# EAGLE schematic Lost-Tile-v1.0.0 v1 (EAGLE 9.7.0)

## Sheet 1 of 5
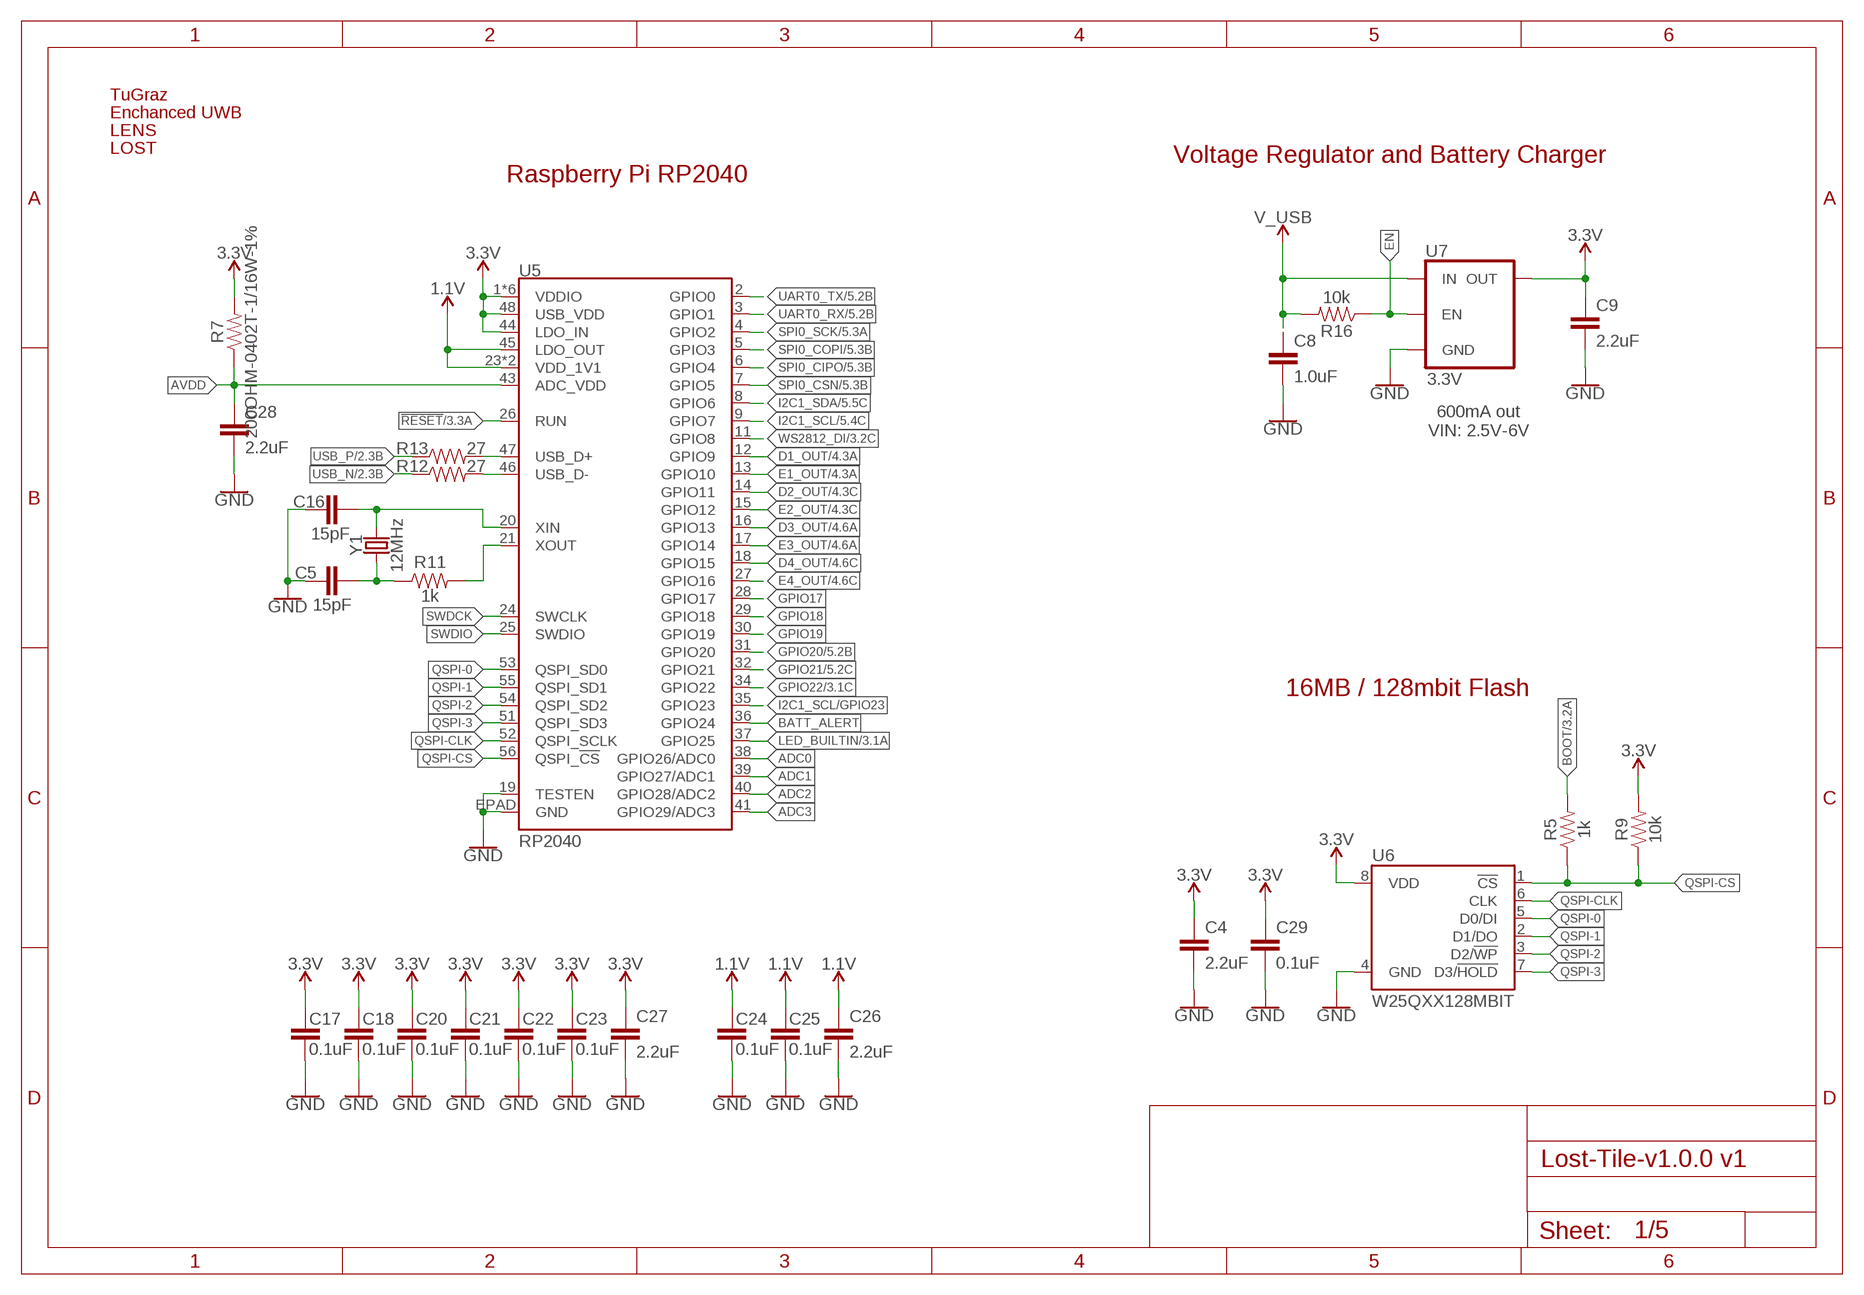
[diagram p0: schematic, sheet 1]

### Parts
C4  2.2uF  2.2UF-0402_TIGHT-10V-10%-X5R  [0402-TIGHT]
C5  15pF  15PF-0402T-50V-5%  [0402-TIGHT]
C8  1.0uF  1.0UF-0402T-16V-10%  [0402-TIGHT]
C9  2.2uF  2.2UF-0402_TIGHT-10V-10%-X5R  [0402-TIGHT]
C16  15pF  15PF-0402T-50V-5%  [0402-TIGHT]
C17  0.1uF  0.1UF-0402T-6.3V-10%-X7R  [0402-TIGHT]
C18  0.1uF  0.1UF-0402T-6.3V-10%-X7R  [0402-TIGHT]
C20  0.1uF  0.1UF-0402T-6.3V-10%-X7R  [0402-TIGHT]
C21  0.1uF  0.1UF-0402T-6.3V-10%-X7R  [0402-TIGHT]
C22  0.1uF  0.1UF-0402T-6.3V-10%-X7R  [0402-TIGHT]
C23  0.1uF  0.1UF-0402T-6.3V-10%-X7R  [0402-TIGHT]
C24  0.1uF  0.1UF-0402T-6.3V-10%-X7R  [0402-TIGHT]
C25  0.1uF  0.1UF-0402T-6.3V-10%-X7R  [0402-TIGHT]
C26  2.2uF  2.2UF-0402_TIGHT-10V-10%-X5R  [0402-TIGHT]
C27  2.2uF  2.2UF-0402_TIGHT-10V-10%-X5R  [0402-TIGHT]
C28  2.2uF  2.2UF-0402_TIGHT-10V-10%-X5R  [0402-TIGHT]
C29  0.1uF  0.1UF-0402T-6.3V-10%-X7R  [0402-TIGHT]
LG1  TU-LOGOSMALL-BICOL  [TU-LOGO-SMALL-BICOL]
LG2  EUWBBICOL  [EUWB_LOGO-BICOL]
LG3  LENS  [LENS]
LG4  LOST_LOGO  [LOST_LOGO]
R5  1k  1KOHM-0402T-1/16W-1%  [0402-TIGHT]
R7  200OHM-0402T-1/16W-1%  [0402-TIGHT]
R9  10k  10KOHM-0402T-1/16W-1%  [0402-TIGHT]
R11  1k  1KOHM-0402T-1/16W-1%  [0402-TIGHT]
R12  27  27OHM  [0402-TIGHT]
R13  27  27OHM  [0402-TIGHT]
R16  10k  10KOHM-0402T-1/16W-1%  [0402-TIGHT]
U5  RP2040  [QFN-56]
U6  W25QXX128MBIT  W25QXX128MBIT-6X5-SKINNY_CENTER  [WSON-8-6X5-SKINNY_CENTERPAD]
U7  3.3V  V_REG_AP2112K-3.3V  [SOT23-5]
Y1  12MHz  CRYSTAL-12MHZ  [CRYSTAL-SMD-2X2.5MM]

### Nets
1.1V: C24.1 C25.1 C26.1 U5.23(VDD_1V1) U5.45(LDO_OUT) U5.50(VDD_1V1)
3.3V: C4.1 C9.1 C17.1 C18.1 C20.1 C21.1 C22.1 C23.1 C27.1 C29.1 R7.2 R9.2 U5.1(VDDIO) U5.10(VDDIO) U5.22(VDDIO) U5.33(VDDIO) U5.42(VDDIO) U5.44(LDO_IN) U5.48(USB_VDD) U5.49(VDDIO) U6.8(VDD) U7.5(OUT) ; also sheet 4,5
!RESET!: U5.26(RUN) ; also sheet 3
ADC0: U5.38(GPIO26/ADC0)
ADC1: U5.39(GPIO27/ADC1)
ADC2: U5.40(GPIO28/ADC2)
ADC3: U5.41(GPIO29/ADC3)
AVDD: C28.1 R7.1 U5.43(ADC_VDD)
BATT_ALERT: U5.36(GPIO24)
BOOT: R5.2 ; also sheet 3
D1_OUT: U5.12(GPIO9) ; also sheet 4
D2_OUT: U5.14(GPIO11) ; also sheet 4
D3_OUT: U5.16(GPIO13) ; also sheet 4
D4_OUT: U5.18(GPIO15) ; also sheet 4
E1_OUT: U5.13(GPIO10) ; also sheet 4
E2_OUT: U5.15(GPIO12) ; also sheet 4
E3_OUT: U5.17(GPIO14) ; also sheet 4
E4_OUT: U5.27(GPIO16) ; also sheet 4
EN: R16.1 U7.3(EN)
GND: C4.2 C5.1 C8.2 C9.2 C16.1 C17.2 C18.2 C20.2 C21.2 C22.2 C23.2 C24.2 C25.2 C26.2 C27.2 C28.2 C29.2 U5.19(TESTEN) U5.EPAD(GND) U6.4(GND) U7.2(GND) ; also sheet 2,3,4,5
GPIO17: U5.28(GPIO17)
GPIO18: U5.29(GPIO18)
GPIO19: U5.30(GPIO19)
GPIO20: U5.31(GPIO20) ; also sheet 5
GPIO21: U5.32(GPIO21) ; also sheet 5
GPIO22: U5.34(GPIO22) ; also sheet 3
I2C1_SCL: U5.9(GPIO7) ; also sheet 5
I2C1_SCL/GPIO23: U5.35(GPIO23)
I2C1_SDA: U5.8(GPIO6) ; also sheet 5
LED_BUILTIN: U5.37(GPIO25) ; also sheet 3
N$4: R11.2 U5.21(XOUT)
N$5: C16.2 U5.20(XIN) Y1.P3
N$6: C5.2 R11.1 Y1.P1
QSPI-0: U5.53(QSPI_SD0) U6.5(D0/DI)
QSPI-1: U5.55(QSPI_SD1) U6.2(D1/DO)
QSPI-2: U5.54(QSPI_SD2) U6.3(D2/!WP!)
QSPI-3: U5.51(QSPI_SD3) U6.7(D3/!HOLD!)
QSPI-CLK [Clock]: U5.52(QSPI_SCLK) U6.6(CLK)
QSPI-CS: R5.1 R9.1 U5.56(QSPI_!CS!) U6.1(!CS!)
SPI0_CIPO: U5.6(GPIO4) ; also sheet 5
SPI0_COPI: U5.5(GPIO3) ; also sheet 5
SPI0_CSN: U5.7(GPIO5) ; also sheet 5
SPI0_SCK: U5.4(GPIO2) ; also sheet 5
SWDCK: U5.24(SWCLK)
SWDIO: U5.25(SWDIO)
UART0_RX: U5.3(GPIO1) ; also sheet 5
UART0_TX: U5.2(GPIO0) ; also sheet 5
USB_F_N: R12.2 U5.46(USB_D-)
USB_F_P: R13.2 U5.47(USB_D+)
USB_N: R12.1 ; also sheet 2
USB_P: R13.1 ; also sheet 2
V_USB: C8.1 R16.2 U7.1(IN) ; also sheet 2,3
WS2812_DI: U5.11(GPIO8) ; also sheet 3

### Notes on the sheet
- Voltage Regulator and Battery Charger
- Raspberry Pi RP2040
- 600mA out
  VIN: 2.5V-6V
- 16MB / 128mbit Flash

## Sheet 2 of 5
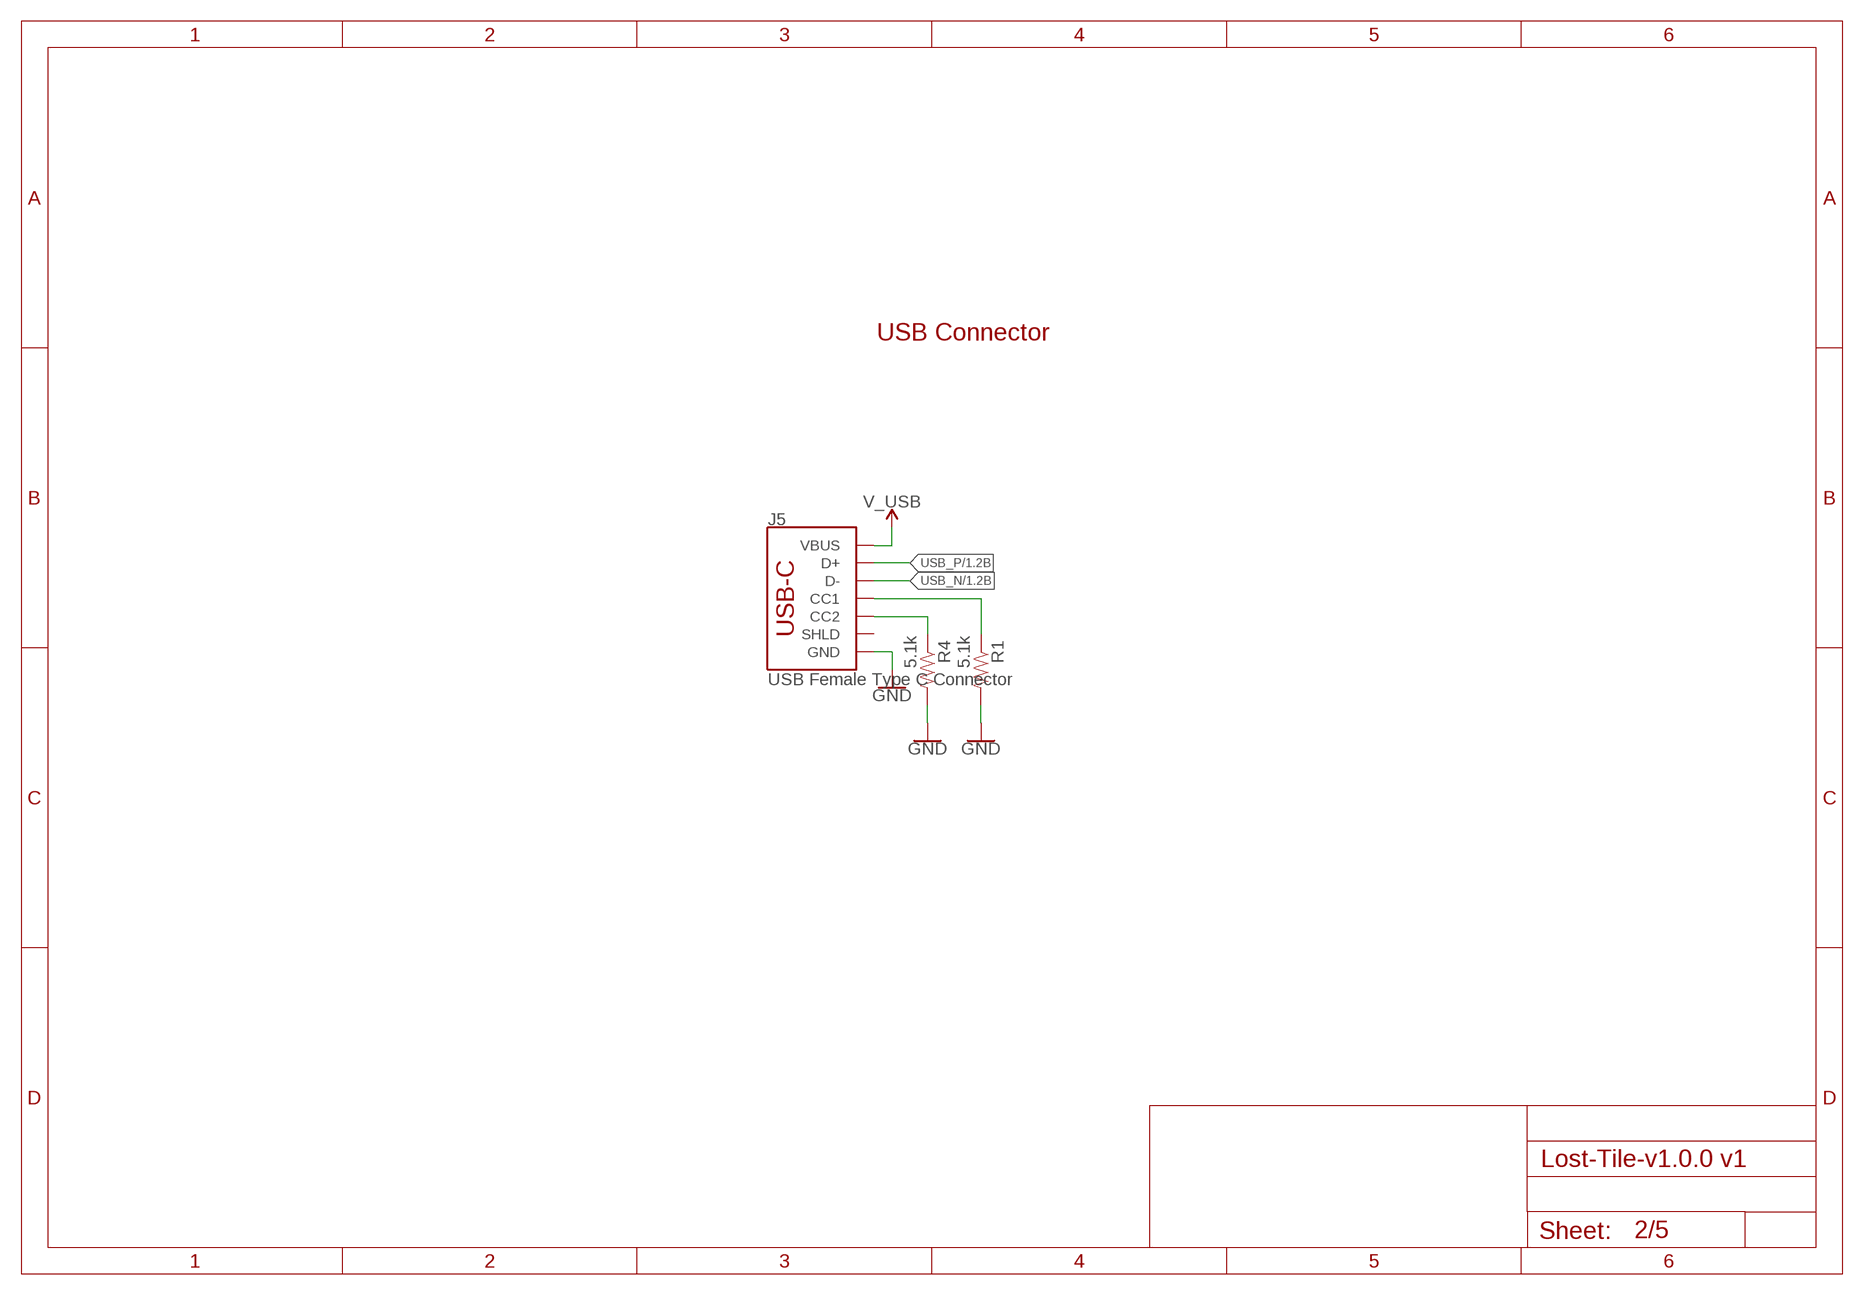
[diagram p1: schematic, sheet 2]

### Parts
J5  USB Female Type C Connector  USB_C_4-LAYER-ISOLATED  [USB-C-16P-4LAYER-ISOLATED]
R1  5.1k  5.1KOHM-0402T-1/16W-1%  [0402-TIGHT]
R4  5.1k  5.1KOHM-0402T-1/16W-1%  [0402-TIGHT]

### Nets
GND: J5.GND J5.GND2(GND) R1.2 R4.2 ; also sheet 1,3,4,5
N$11: J5.A5(CC1) R1.1
N$12: J5.B5(CC2) R4.1
USB_N: J5.A7(D-) J5.B7(D-) ; also sheet 1
USB_P: J5.A6(D+) J5.B6(D+) ; also sheet 1
V_USB: J5.VBUS1(VBUS) J5.VBUS2(VBUS) ; also sheet 1,3
Unconnected: J5.SHLD1(SHLD) J5.SHLD2(SHLD) J5.SHLD3(SHLD) J5.SHLD4(SHLD) J5.SHLD5(SHLD) J5.SHLD6(SHLD) J5.SHLD7(SHLD) J5.SHLD8(SHLD)

### Notes on the sheet
- USB Connector

## Sheet 3 of 5
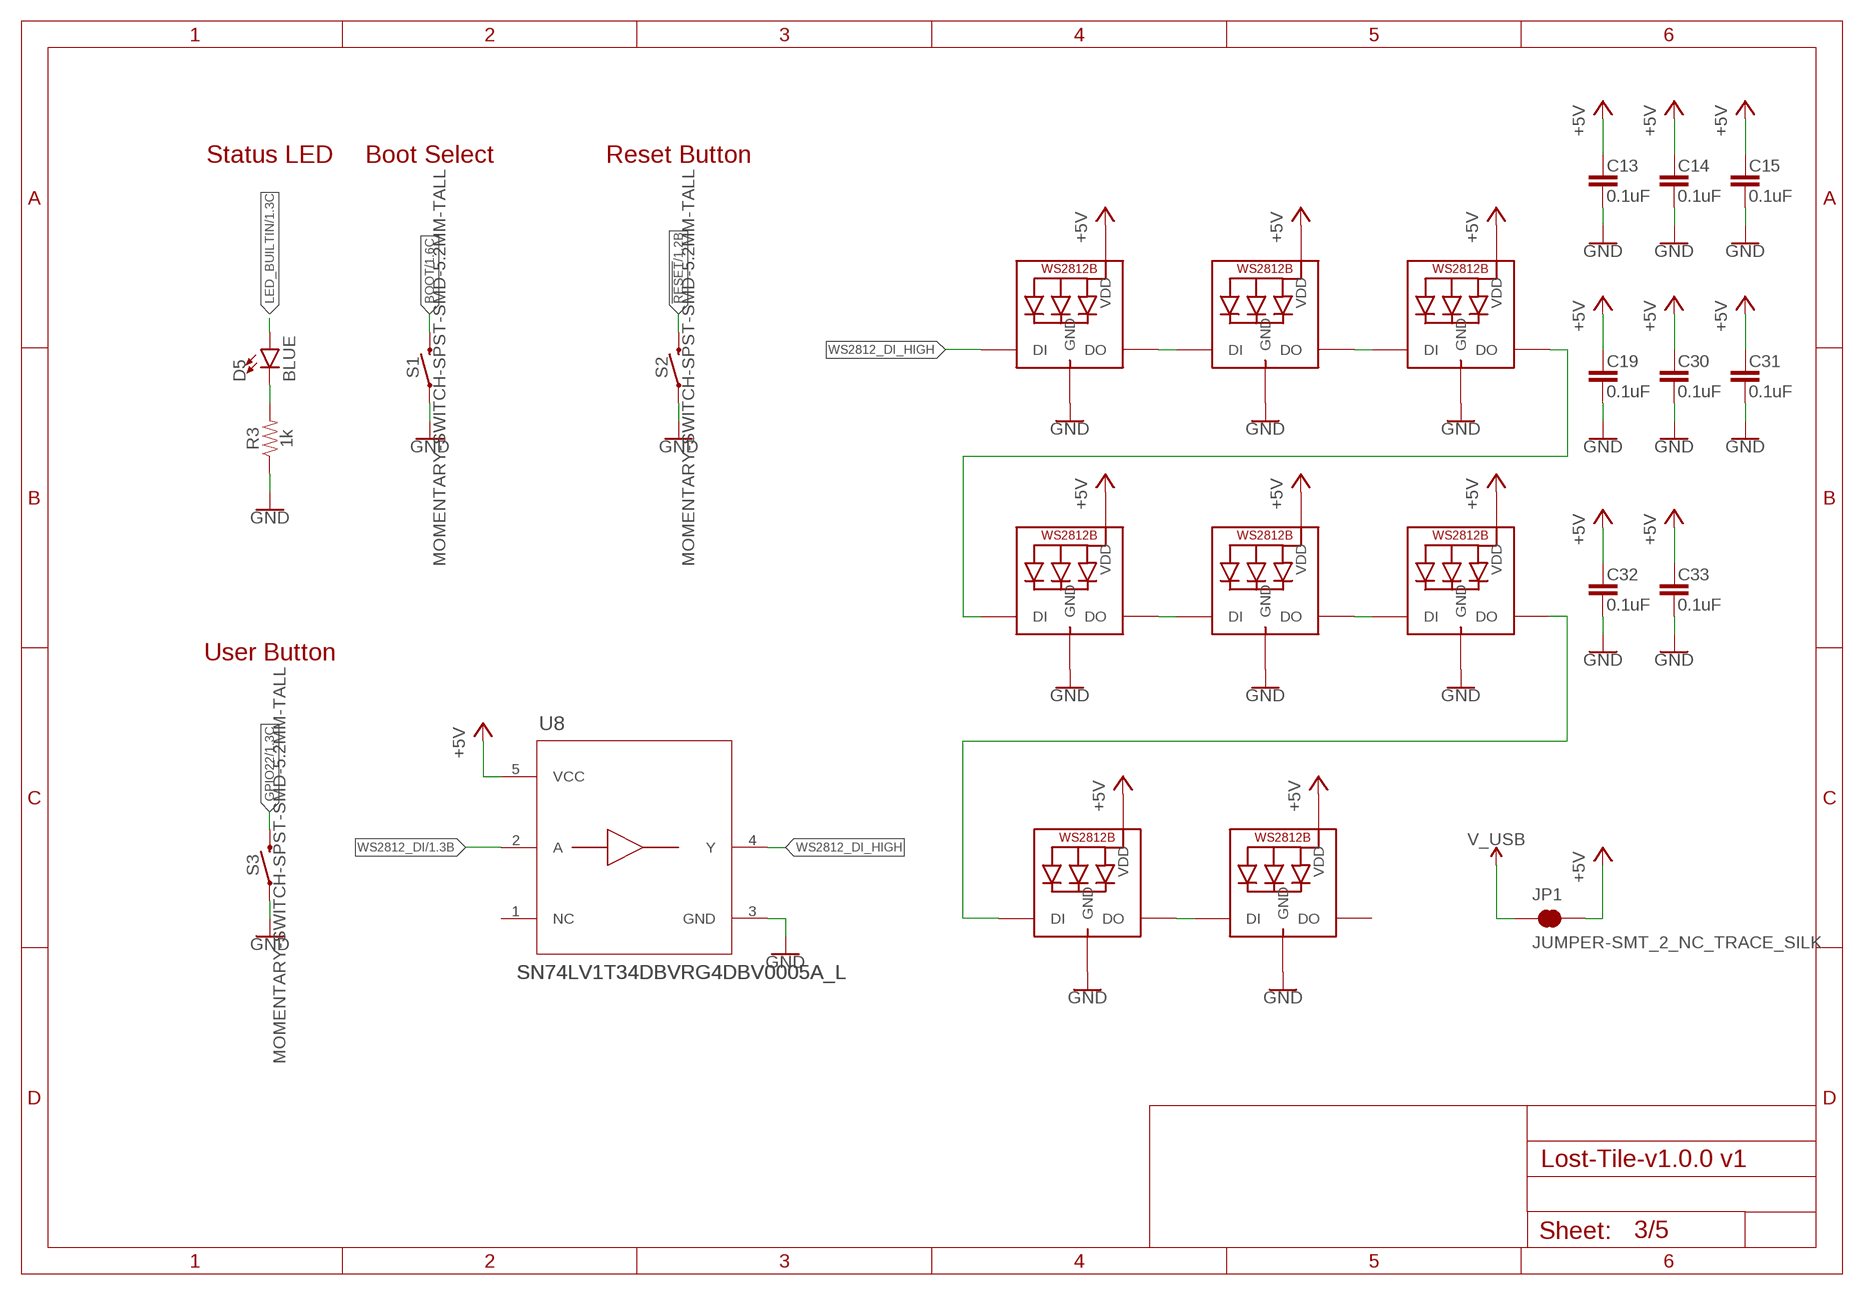
[diagram p2: schematic, sheet 3]

### Parts
C13  0.1uF  0.1UF-0402T-6.3V-10%-X7R  [0402-TIGHT]
C14  0.1uF  0.1UF-0402T-6.3V-10%-X7R  [0402-TIGHT]
C15  0.1uF  0.1UF-0402T-6.3V-10%-X7R  [0402-TIGHT]
C19  0.1uF  0.1UF-0402T-6.3V-10%-X7R  [0402-TIGHT]
C30  0.1uF  0.1UF-0402T-6.3V-10%-X7R  [0402-TIGHT]
C31  0.1uF  0.1UF-0402T-6.3V-10%-X7R  [0402-TIGHT]
C32  0.1uF  0.1UF-0402T-6.3V-10%-X7R  [0402-TIGHT]
C33  0.1uF  0.1UF-0402T-6.3V-10%-X7R  [0402-TIGHT]
D5  BLUE  LED-BLUE0603  [LED-0603]
JP1  JUMPER-SMT_2_NC_TRACE_SILK  [SMT-JUMPER_2_NC_TRACE_SILK]
LED1  WS2812B5050  [WS2812B]
LED2  WS2812B5050  [WS2812B]
LED3  WS2812B5050  [WS2812B]
LED4  WS2812B5050  [WS2812B]
LED5  WS2812B5050  [WS2812B]
LED6  WS2812B5050  [WS2812B]
LED7  WS2812B5050  [WS2812B]
LED8  WS2812B5050  [WS2812B]
R3  1k  1KOHM-0402T-1/16W-1%  [0402-TIGHT]
S1  MOMENTARY-SWITCH-SPST-SMD-5.2MM-TALL  [TACTILE_SWITCH_SMD_5.2MM]
S2  MOMENTARY-SWITCH-SPST-SMD-5.2MM-TALL  [TACTILE_SWITCH_SMD_5.2MM]
S3  MOMENTARY-SWITCH-SPST-SMD-5.2MM-TALL  [TACTILE_SWITCH_SMD_5.2MM]
U8  SN74LV1T34DBVRG4DBV0005A_L  [DBV0005A_L]

### Nets
!RESET!: S2.3 ; also sheet 1
+5V: C13.1 C14.1 C15.1 C19.1 C30.1 C31.1 C32.1 C33.1 JP1.2 LED1.1-VDD(VDD) LED2.1-VDD(VDD) LED3.1-VDD(VDD) LED4.1-VDD(VDD) LED5.1-VDD(VDD) LED6.1-VDD(VDD) LED7.1-VDD(VDD) LED8.1-VDD(VDD) U8.5(VCC) ; also sheet 5
BOOT: S1.3 ; also sheet 1
GND: C13.2 C14.2 C15.2 C19.2 C30.2 C31.2 C32.2 C33.2 LED1.3-GND(GND) LED2.3-GND(GND) LED3.3-GND(GND) LED4.3-GND(GND) LED5.3-GND(GND) LED6.3-GND(GND) LED7.3-GND(GND) LED8.3-GND(GND) R3.1 S1.1 S2.1 S3.1 U8.3(GND) ; also sheet 1,2,4,5
GPIO22: S3.3 ; also sheet 1
LED_BUILTIN: D5.A ; also sheet 1
N$1: D5.C R3.2
N$2: LED1.2-DOUT(DO) LED2.4-DIN(DI)
N$3: LED2.2-DOUT(DO) LED3.4-DIN(DI)
N$7: LED6.2-DOUT(DO) LED7.4-DIN(DI)
N$9: LED3.2-DOUT(DO) LED4.4-DIN(DI)
N$10: LED7.2-DOUT(DO) LED8.4-DIN(DI)
N$13: LED4.2-DOUT(DO) LED5.4-DIN(DI)
N$14: LED5.2-DOUT(DO) LED6.4-DIN(DI)
V_USB: JP1.1 ; also sheet 1,2
WS2812_DI: U8.2(A) ; also sheet 1
WS2812_DI_HIGH: LED1.4-DIN(DI) U8.4(Y)
Unconnected: LED8.2-DOUT(DO) U8.1(NC)

### Notes on the sheet
- Status LED | Boot Select | Reset Button
- User Button

## Sheet 4 of 5
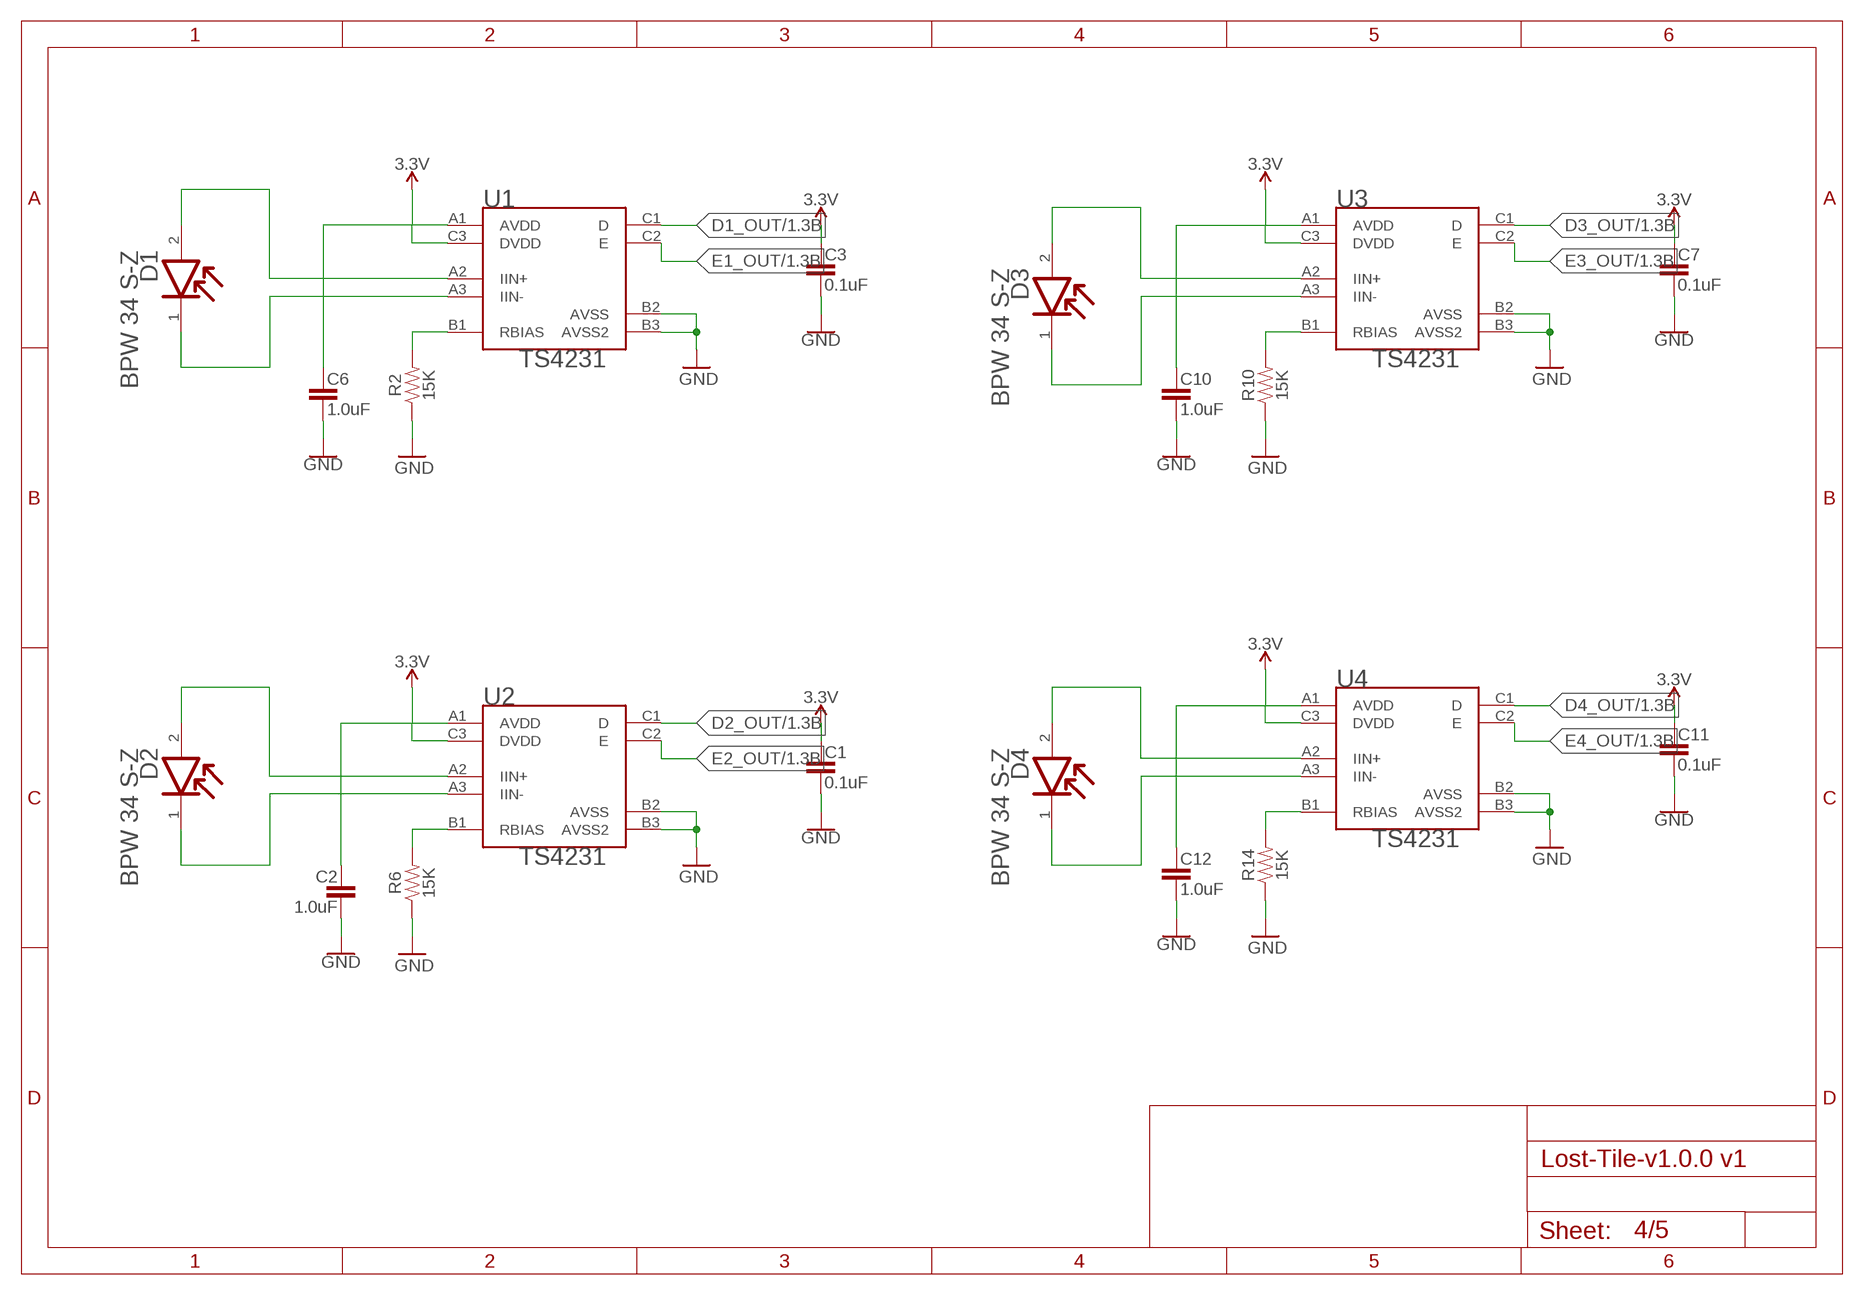
[diagram p3: schematic, sheet 4]

### Parts
C1  0.1uF  0.1UF-0402T-6.3V-10%-X7R  [0402-TIGHT]
C2  1.0uF  1.0UF-0402T-16V-10%  [0402-TIGHT]
C3  0.1uF  0.1UF-0402T-6.3V-10%-X7R  [0402-TIGHT]
C6  1.0uF  1.0UF-0402T-16V-10%  [0402-TIGHT]
C7  0.1uF  0.1UF-0402T-6.3V-10%-X7R  [0402-TIGHT]
C10  1.0uF  1.0UF-0402T-16V-10%  [0402-TIGHT]
C11  0.1uF  0.1UF-0402T-6.3V-10%-X7R  [0402-TIGHT]
C12  1.0uF  1.0UF-0402T-16V-10%  [0402-TIGHT]
D1  OSRAM_OPTO_SEMICONDUCTORS_INC._BPW_34_S-ZOSRAM_OPTO_SEMICONDUCTORS_INC._BPW_34_S-Z_0_0  [OSRAM_OPTO_SEMICONDUCTORS_INC._BPW_34_S-Z_0]
D2  OSRAM_OPTO_SEMICONDUCTORS_INC._BPW_34_S-ZOSRAM_OPTO_SEMICONDUCTORS_INC._BPW_34_S-Z_0_0  [OSRAM_OPTO_SEMICONDUCTORS_INC._BPW_34_S-Z_0]
D3  OSRAM_OPTO_SEMICONDUCTORS_INC._BPW_34_S-ZOSRAM_OPTO_SEMICONDUCTORS_INC._BPW_34_S-Z_0_0  [OSRAM_OPTO_SEMICONDUCTORS_INC._BPW_34_S-Z_0]
D4  OSRAM_OPTO_SEMICONDUCTORS_INC._BPW_34_S-ZOSRAM_OPTO_SEMICONDUCTORS_INC._BPW_34_S-Z_0_0  [OSRAM_OPTO_SEMICONDUCTORS_INC._BPW_34_S-Z_0]
R2  15K  15KOHM-0402-TIGHT-1/16THW-1%  [0402-TIGHT]
R6  15K  15KOHM-0402-TIGHT-1/16THW-1%  [0402-TIGHT]
R10  15K  15KOHM-0402-TIGHT-1/16THW-1%  [0402-TIGHT]
R14  15K  15KOHM-0402-TIGHT-1/16THW-1%  [0402-TIGHT]
U1  TRIAD_SEMI_TS4231TRIAD_SEMI_TS4231_0_0  [TRIAD_SEMI_TS4231_0]
U2  TRIAD_SEMI_TS4231TRIAD_SEMI_TS4231_0_0  [TRIAD_SEMI_TS4231_0]
U3  TRIAD_SEMI_TS4231TRIAD_SEMI_TS4231_0_0  [TRIAD_SEMI_TS4231_0]
U4  TRIAD_SEMI_TS4231TRIAD_SEMI_TS4231_0_0  [TRIAD_SEMI_TS4231_0]

### Nets
3.3V: C1.1 C3.1 C7.1 C11.1 U1.C3(DVDD) U2.C3(DVDD) U3.C3(DVDD) U4.C3(DVDD) ; also sheet 1,5
D1_OUT: U1.C1(D) ; also sheet 1
D2_OUT: U2.C1(D) ; also sheet 1
D3_OUT: U3.C1(D) ; also sheet 1
D4_OUT: U4.C1(D) ; also sheet 1
E1_OUT: U1.C2(E) ; also sheet 1
E2_OUT: U2.C2(E) ; also sheet 1
E3_OUT: U3.C2(E) ; also sheet 1
E4_OUT: U4.C2(E) ; also sheet 1
GND: C1.2 C2.2 C3.2 C6.2 C7.2 C10.2 C11.2 C12.2 R2.1 R6.1 R10.1 R14.1 U1.B2(AVSS) U1.B3(AVSS2) U2.B2(AVSS) U2.B3(AVSS2) U3.B2(AVSS) U3.B3(AVSS2) U4.B2(AVSS) U4.B3(AVSS2) ; also sheet 1,2,3,5
IIN1+: D1.2(ANODE) U1.A2(IIN+)
IIN1-: D1.1(CATHODE) U1.A3(IIN-)
IIN2+: D2.2(ANODE) U2.A2(IIN+)
IIN2-: D2.1(CATHODE) U2.A3(IIN-)
IIN3+: D3.2(ANODE) U3.A2(IIN+)
IIN3-: D3.1(CATHODE) U3.A3(IIN-)
IIN4+: D4.2(ANODE) U4.A2(IIN+)
IIN4-: D4.1(CATHODE) U4.A3(IIN-)
N$8: C6.1 U1.A1(AVDD)
N$15: C10.1 U3.A1(AVDD)
N$16: C2.1 U2.A1(AVDD)
N$17: C12.1 U4.A1(AVDD)
RBIAS: R2.2 U1.B1(RBIAS)
RBIAS1: R6.2 U2.B1(RBIAS)
RBIAS2: R10.2 U3.B1(RBIAS)
RBIAS3: R14.2 U4.B1(RBIAS)

## Sheet 5 of 5
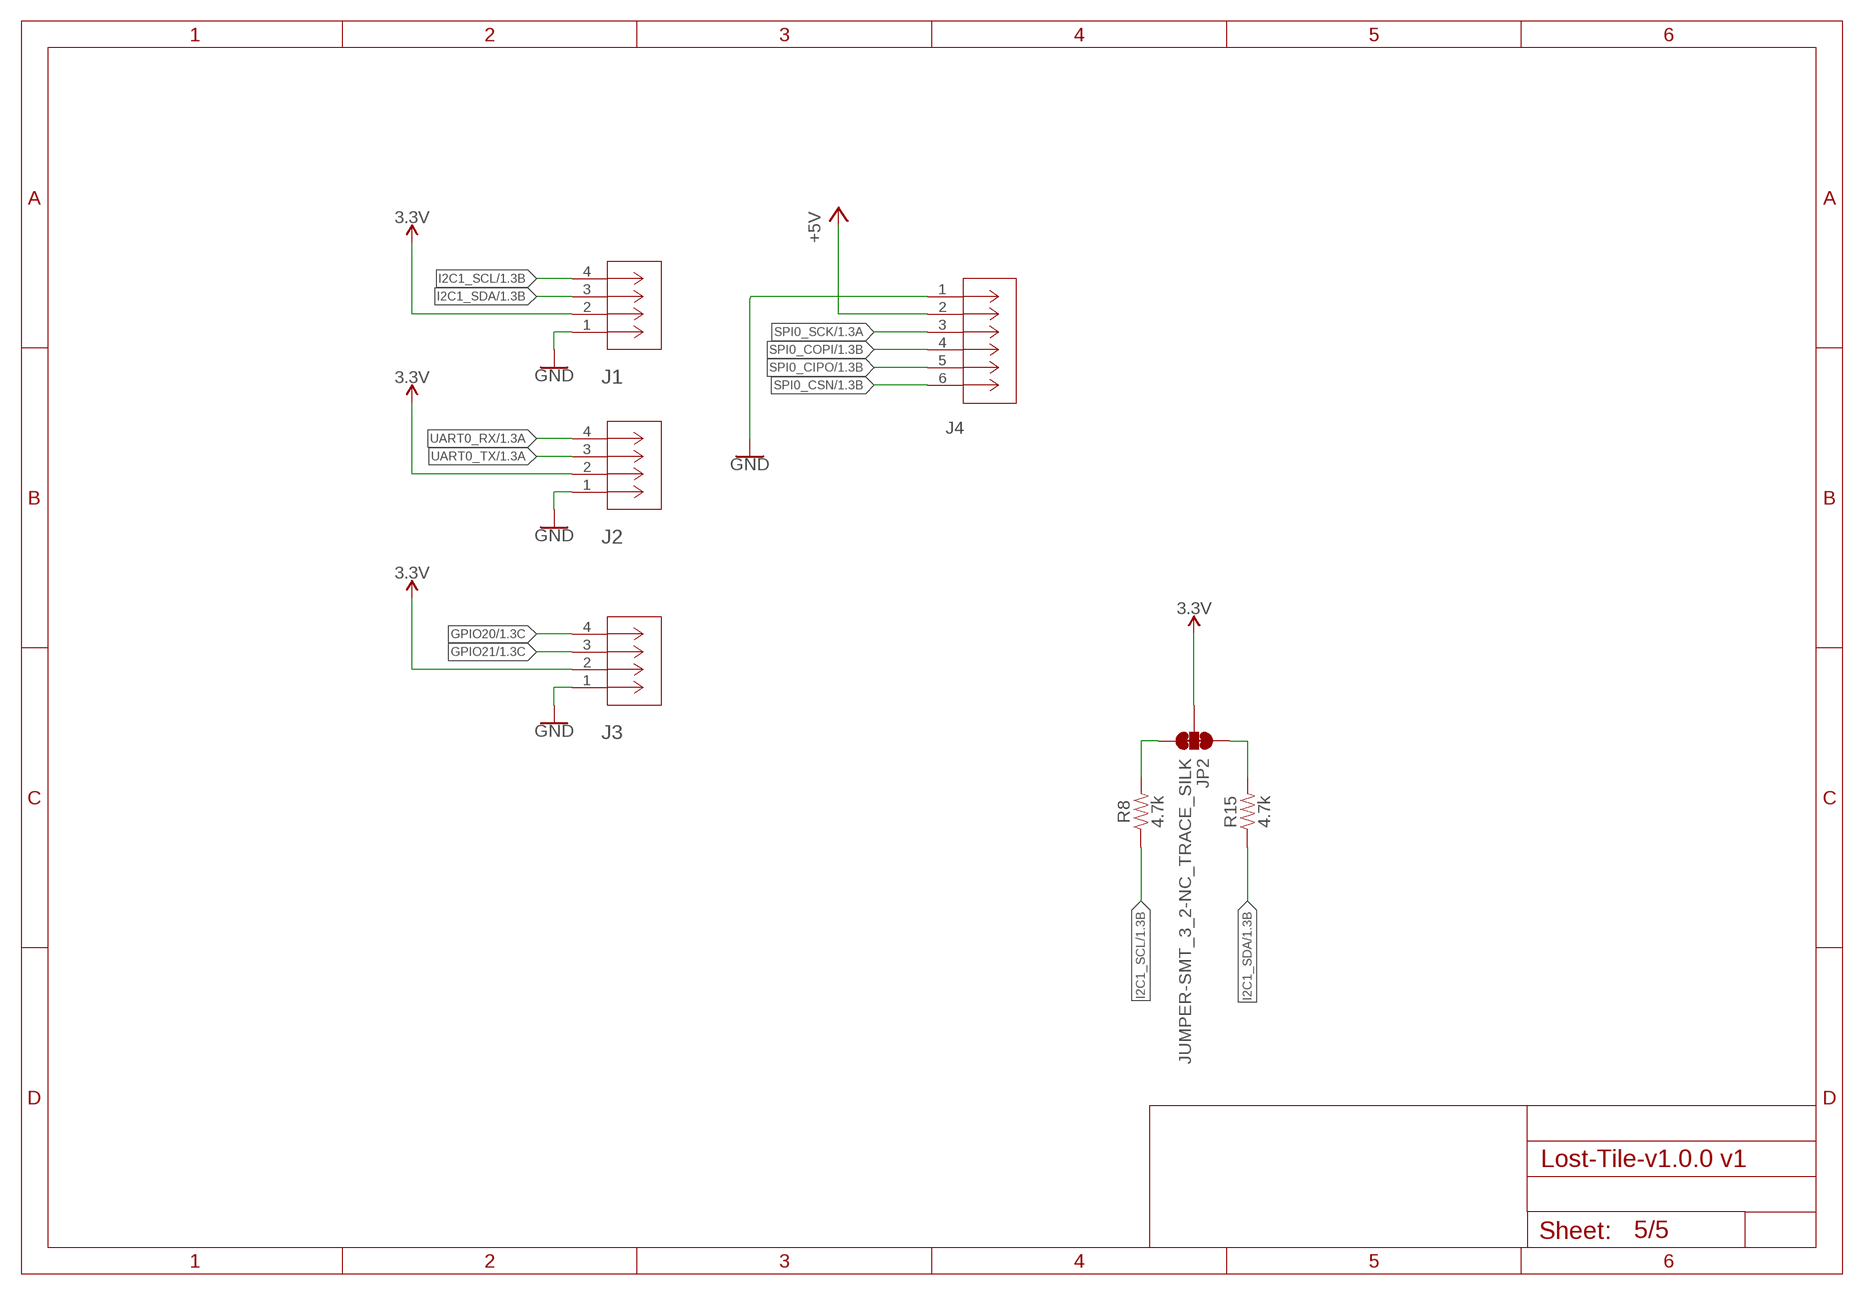
[diagram p4: schematic, sheet 5]

### Parts
J1  BM04B-SRSS-TBT_(LF)(SN)CONN_BM04B-SRSS-TBT_(LF)(SN)_J  [CONN_BM04B-SRSS-TBT_(LF)(SN)_J]
J2  BM04B-SRSS-TBT_(LF)(SN)CONN_BM04B-SRSS-TBT_(LF)(SN)_J  [CONN_BM04B-SRSS-TBT_(LF)(SN)_J]
J3  BM04B-SRSS-TBT_(LF)(SN)CONN_BM04B-SRSS-TBT_(LF)(SN)_J  [CONN_BM04B-SRSS-TBT_(LF)(SN)_J]
J4  BM06B-SRSS-TB(LF)(SN)CONN_BM06B-SRSS-TB_JST  [CONN_BM06B-SRSS-TB_JST]
JP2  JUMPER-SMT_3_2-NC_TRACE_SILK  [SMT-JUMPER_3_2-NC_TRACE_SILK]
R8  4.7k  4.7KOHM-0402T-1/16W-1%  [0402-TIGHT]
R15  4.7k  4.7KOHM-0402T-1/16W-1%  [0402-TIGHT]

### Nets
3.3V: J1.2 J2.2 J3.2 JP2.2 ; also sheet 1,4
+5V: J4.2 ; also sheet 3
GND: J1.1 J2.1 J3.1 J4.1 ; also sheet 1,2,3,4
GPIO20: J3.4 ; also sheet 1
GPIO21: J3.3 ; also sheet 1
I2C1_SCL: J1.4 R8.1 ; also sheet 1
I2C1_SDA: J1.3 R15.1 ; also sheet 1
N$18: JP2.3 R8.2
N$19: JP2.1 R15.2
SPI0_CIPO: J4.5 ; also sheet 1
SPI0_COPI: J4.4 ; also sheet 1
SPI0_CSN: J4.6 ; also sheet 1
SPI0_SCK: J4.3 ; also sheet 1
UART0_RX: J2.4 ; also sheet 1
UART0_TX: J2.3 ; also sheet 1

## Library data of the parts
C1 C3 C7 C11 C13-C15 C17-C25 C29-C33 = SparkFun-Capacitors:0.1UF: 0.1µF ceramic capacitors A capacitor is a passive two-terminal electrical component used to store electrical energy temporarily in an electric field.; PROD_ID: CAP-14993
C2 C6 C8 C10 C12 = SparkFun-Capacitors:1.0UF: 1µF ceramic capacitors A capacitor is a passive two-terminal electrical component used to store electrical energy temporarily in an electric field.; PROD_ID: CAP-12417
C4 C9 C26-C28 = SparkFun-Capacitors:2.2UF: 2.2µF ceramic capacitors A capacitor is a passive two-terminal electrical component used to store electrical energy temporarily in an electric field.; PROD_ID: CAP-14232
C5 C16 = SparkFun-Capacitors:15PF: 15pF ceramic capacitors A capacitor is a passive two-terminal electrical component used to store electrical energy temporarily in an electric field.; PROD_ID: CAP-13063
D1-D4 = OSRAM Opto Semiconductors Inc. - BPW 34 S-Z:OSRAM_OPTO_SEMICONDUCTORS_INC._BPW_34_S-Z: Silicon PIN Photodiode; CENTROID_NOT_SPECIFIED: No; DATASHEET: https://dammedia.osram.info/media/resource/hires/osram-dam-2495872/BPW%2034%20S.pdf; DIGIKEY_DESCRIPTION: DIODE PHOTODIODE SMT; DIGIKEY_PART_NUMBER: 475-2659-1-ND; LEAD_FREE: yes; MF: OSRAM Opto Semiconductors Inc.; MOUSER_PART_NUMBER: 720-BPW34S-Z; MPN: BPW 34 S-Z; PACKAGE: SMT_6MM45_3MM85; PREFIX: D; ROHS: yes; TEMPERATURE_RANGE_HIGH: +100°C; TEMPERATURE_RANGE_LOW: -40°C
D5 = SparkFun-LED:LED-BLUE: Blue SMD LED Used in manufacturing of various products at SparkFun Packages: 0603 - SMD 0603 package [Product Link] <http://www.digikey.com/product-detail/en/SMLE12BC7TT86/511-1589-2-ND/1641808> 1206 - SMD1206 package [Product Link] <http://www.digikey.com/product-detail/en/lite-on-inc/LTST-C150TBKT/160-1643-1-ND/573584> SparkFun Products: ESP8266 Thing-Dev Board <https://www.sparkfun.com/products/13711> RedBoard <https://www.sparkfun.com/products/12757>; PROD_ID: DIO-08575
J1-J3 = 2024-01-04_12-28-16_Library:BM04B-SRSS-TBT_(LF)(SN); COPYRIGHT: Copyright (C) 2024 Ultra Librarian. All rights reserved.; MANUFACTURER_PART_NUMBER: BM04B-SRSS-TBT (LF)(SN); MFR_NAME: JST
J4 = 2024-01-04_12-26-39_Library:BM06B-SRSS-TB(LF)(SN); COPYRIGHT: Copyright (C) 2024 Ultra Librarian. All rights reserved.; MANUFACTURER_PART_NUMBER: BM06B-SRSS-TB(LF)(SN); MFR_NAME: JST
J5 = SparkFun-Connectors:USB_C: USB Type C 16Pin Connector Super Speed pins not available on the 16-pin purely SMD connector so this part is best for USB 2.0 implementations. D1 and D2 are tied together enabling D+/- no matter which way the cable is plugged into the connector. The two channel configuration pins (CC1/2) are exposed. These are normally connected to ground via 5.1k resistors but can be reconfigured for high current/high power applications. **4-LAYER BOARD WARNING!!** If designing 4-layer board, make sure to select the variant _4-LAYER-ISOLATED. The linked footprint (USB-C-16-4LAYER-ISOLATED) includes some very necessary cutout polygons in the inner layers (2 and 15). This prevents the PTH mounting shield legs on the USB connector from electrically connecting any other polygons on the inner layers (usually VCC and GND).; PROD_ID: CONN-14122
JP1 = SparkFun-Jumpers:JUMPER-SMT_2_NC_TRACE: Normally closed trace jumper This jumper has a trace between two pads so it's normally closed (NC). Use a razor knife to open the connection. For best results follow the IPC guidelines for cutting traces: Cutout at least 0.063 mm (0.005 in). Remove all loose material to clean up the cut area. Seal the cut with an approved epoxy. Reapply solder to reclose the connection.
JP2 = SparkFun-Jumpers:JUMPER-SMT_3_2-NC_TRACE: Normally closed trace jumper (2 of 2 connections) This jumper has a trace between all three pads so they are normally closed (NC). Use a razor knife to open the connection(s). For best results follow the IPC guidelines for cutting traces: Cutout at least 0.063 mm (0.005 in). Remove all loose material to clean up the cut area. Seal the cut with an approved epoxy. Reapply solder to reclose the connection(s).
LED1-LED8 = adafruit:WS2812B
LG1 = tugraz:TU-LOGO
LG2 = euwb_logo:EUWB
LG3 = lens_logo:LENS
LG4 = LOST_Logo:LOST_LOGO
R1 R4 = SparkFun-Resistors:5.1KOHM; PROD_ID: RES-14340
R2 R6 R10 R14 = SparkFun-Resistors:15KOHM: 15kΩ resistor A resistor is a passive two-terminal electrical component that implements electrical resistance as a circuit element. Resistors act to reduce current flow, and, at the same time, act to lower voltage levels within circuits. - Wikipedia; PROD_ID: RES-15004
R3 R5 R11 = SparkFun-Resistors:1KOHM: 1kΩ resistor A resistor is a passive two-terminal electrical component that implements electrical resistance as a circuit element. Resistors act to reduce current flow, and, at the same time, act to lower voltage levels within circuits. - Wikipedia; PROD_ID: RES-14342
R7 = SparkFun-Resistors:200OHM: 200Ω resistor A resistor is a passive two-terminal electrical component that implements electrical resistance as a circuit element. Resistors act to reduce current flow, and, at the same time, act to lower voltage levels within circuits. - Wikipedia; PROD_ID: RES-15550
R8 R15 = SparkFun-Resistors:4.7KOHM: 4.7kΩ resistor A resistor is a passive two-terminal electrical component that implements electrical resistance as a circuit element. Resistors act to reduce current flow, and, at the same time, act to lower voltage levels within circuits. - Wikipedia; PROD_ID: RES-15343
R9 R16 = SparkFun-Resistors:10KOHM: 10kΩ resistor A resistor is a passive two-terminal electrical component that implements electrical resistance as a circuit element. Resistors act to reduce current flow, and, at the same time, act to lower voltage levels within circuits. - Wikipedia; PROD_ID: RES-14241
R12 R13 = SparkFun-Resistors:27OHM: 27Ω resistor A resistor is a passive two-terminal electrical component that implements electrical resistance as a circuit element. Resistors act to reduce current flow, and, at the same time, act to lower voltage levels within circuits. - Wikipedia; PROD_ID: RES-15238
S1-S3 = SparkFun-Switches:MOMENTARY-SWITCH-SPST: Momentary Switch (Pushbutton) - SPST Normally-open (NO) SPST momentary switches (buttons, pushbuttons). Variants PTH-12MM - 12mm square, through-hole Momentary Pushbutton Switch - 12mm Square <https://www.sparkfun.com/products/9190> (COM-09190) PTH-6.0MM, PTH-6.0MM-KIT - 6.0mm square, through-hole Mini Pushbutton Switch <https://www.sparkfun.com/products/97> (COM-00097) KIT package intended for soldering kit's - only one side of pads' copper is exposed. PTH-RIGHT-ANGLE-KIT - Right-angle, through-hole Right Angle Tactile Button <https://www.sparkfun.com/products/10791> - Used on SparkFun BigTime Watch Kit <https://www.sparkfun.com/products/11734> SMD-12MM - 12mm square, surface-mount Tactile Button - SMD (12mm) <https://www.sparkfun.com/products/12993> (COM-12993) Used on SparkFun PicoBoard <https://www.sparkfun.com/products/11888> SMD-4.5MM - 4.5mm Square Trackball Switch Used on SparkFun Blackberry Trackballer Breakout <https://www.sparkfun.com/products/13169> SMD-4.6MMX2.8MM - 4.60mm x 2.80mm, surface mount Used on SparkFun Pro Micro - RP2040 <https://www.sparkfun.com/products/17717> SMD-5.2MM, SMD-5.2-REDUNDANT - 5.2mm square, surface-mount Mini Pushbutton Switch - SMD <https://www.sparkfun.com/products/8720> (COM-08720) Used on Arduino Pro Mini <https://www.sparkfun.com/products/11114> REDUNDANT package connects both switch circuits together SMD-6.0X3.5MM - 6.0 x 3.5mm, surface mount Momentary Reset Switch SMD <https://www.sparkfun.com/products/8229> (COM-08229) SMD-6.2MM-TALL - 6.2mm square, surface mount Tactile Button - SMD (6mm) <https://www.sparkfun.com/products/12992> Used on SparkFun Digital Sandbox <https://www.sparkfun.com/products/12651> SMD-RIGHT-ANGLE - Right-angle, surface mount Used on SparkFun Block for Intel® Edison - Arduino <https://www.sparkfun.com/products/13036>; PROD_ID: SWCH-14139
U1-U4 = Triad Semi - TS4231:TRIAD_SEMI_TS4231: TS4231 Light to Digital Converter; DATASHEET: https://www.triadsemi.com/wp-content/uploads/dlm_uploads/2017/06/triad_semi_ts4231_datasheet_rev_a.pdf; IPC_LAND_PATTERN_NAME: BGA9N50P3X3_166X166X55; MF: Triad Semi; MPN: TS4231; PACKAGE: WLSCP9; PREFIX: U; TEMPERATURE_HIGH: 150°C; TEMPERATURE_LOW: -40°C; VOLTAGE: 3V - 3.6V
U5 = parts:RP2040: Raspberry Pi RP2040 MCU 56-pin 32-bit Microcontroller with 264kB of SRAM and external flash support up to 16MB Getting Started with the RP2040 <https://pico.raspberrypi.org/getting-started/> Dual-core ARM Cortex M0+ processor, flexible clock running up to 133 MHz 264kB of SRAM, and QSPI control of common flash memory USB 1.1 Host and Device support Low-power sleep and dormant modes Drag & drop programming using mass storage over USB 26 multi-function GPIO pins 2×SPI, 2×I2C, 2×UART, 3×12-bit ADC, 16×controllable PWM channels Accurate clock and timer on-chip Temperature sensor Accelerated floating point libraries on-chip 8×Programmable IO (PIO) state machines for custom peripheral support; PROD_ID: IC-15502
U6 = SparkFun-IC-Memory:W25QXX; PROD_ID: IC-15107
U7 = SparkFun-IC-Power:V_REG_AP2112: AP2112 - 600mA CMOS LDO Regulator w/ Enable The AP2112 is CMOS process low dropout linear regulator with enable function, the regulator delivers a guaranteed 600mA (min.) continuous load current. Features Output Voltage Accuracy: ±1.5% Output Current: 600mA (Min.) Foldback Short Current Protection: 50mA Enable Function to Turn ON/OFF VOUT Low Dropout Voltage (3.3V): 250mV (Typ.) @IOUT=600mA Excellent Load Regulation: 0.2%/A (Typ.) Excellent Line Regulation: 0.02%/V (Typ.) Low Quiescent Current: 55μA (Typ.) Low Standby Current: 0.01μA (Typ.) Low Output Noise: 50μVRMS PSRR: 100Hz -65dB, 1kHz -65dB OTSD Protection Stable with 1.0μF Flexible Cap: Ceramic, Tantalum and Aluminum Electrolytic Operation Temperature Range: -40°C to 85°C ESD: MM 400V, HBM 4000V; PROD_ID: VREG-12457
U8 = 2024-01-08_16-33-13_Library:SN74LV1T34DBVRG4; COPYRIGHT: Copyright (C) 2024 Ultra Librarian. All rights reserved.; MANUFACTURER_PART_NUMBER: SN74LV1T34DBVRG4; MFR_NAME: Texas Instruments; REFDES: RefDes; TYPE: TYPE
Y1 = SparkFun-Clocks:CRYSTAL-12MHZ: 12.0MHz Crystal Frequency: 12.0MHz Frequency Tolerance: ±20ppm Load Capacitance: 18pF SparkFun Products: SparkFun Logomatic <https://www.sparkfun.com/products/12772> Pocket AVR Programmer <https://www.sparkfun.com/products/9825>; PROD_ID: XTAL-15540

## Net classes
2 Clock: width 0.089 mm, clearance 0.178 mm